# EAGLE design Adapter (EAGLE 6.5.0)
COPYRIGHT: based on Karl-Heinz Kübbeler's circuit; PROJECT_INFO: Rotary Encoder & Frequency Counter; PROJECT_NAME: Options Adapter for Component Tester
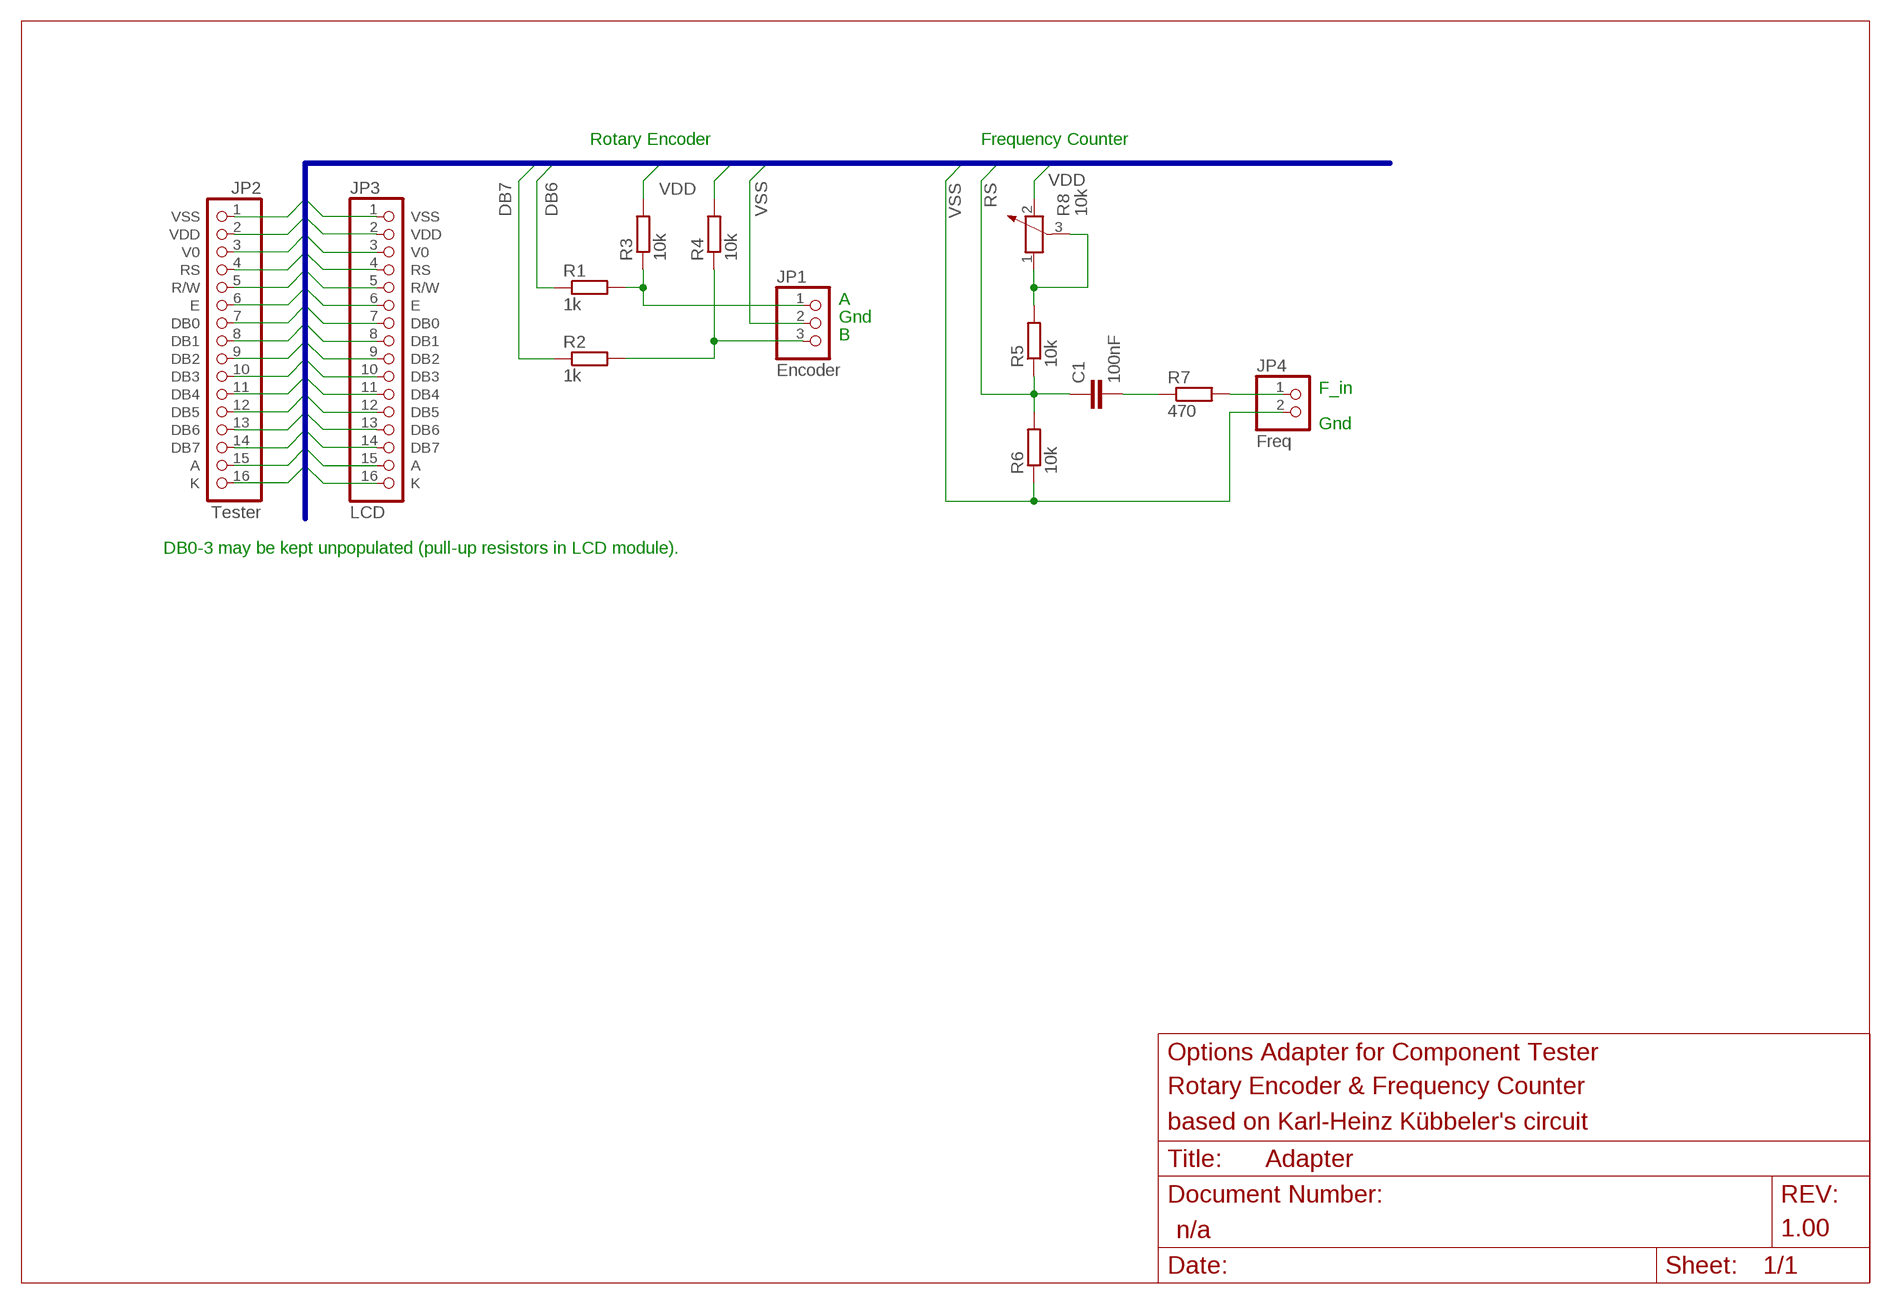
[diagram p0: schematic, sheet 1]
FRAME1 (FRAME_A4): DOCUMENT_ID: n/a; REVISION_ID: 1.00

## Parts
C1  100nF  C-EU050-025X075  [C050-025X075]
JP1  Encoder  PINHD-1X3-PCB  [PINHD-1X03]
JP2  Tester  PINHD-1X16-LCD-TOP  [PINHD-1X16]
JP3  LCD  PINHD-1X16-LCD-TOP  [PINHD-1X16]
JP4  Freq  PINHD-1X2-PCB  [PINHD-1X02]
R1  1k  R-EU_0207/10  [0207/10]
R2  1k  R-EU_0207/10  [0207/10]
R3  10k  R-EU_0207/5V  [0207/5V]
R4  10k  R-EU_0207/5V  [0207/5V]
R5  10k  R-EU_0207/5V  [0207/5V]
R6  10k  R-EU_0207/5V  [0207/5V]
R7  470  R-EU_0207/5V  [0207/5V]
R8  10k  POTENTIOMETER_PT-10  [PT-10]

## Nets
A: JP2.15(A) JP3.15(A)
DB0: JP2.7(DB0) JP3.7(DB0)
DB1: JP2.8(DB1) JP3.8(DB1)
DB2: JP2.9(DB2) JP3.9(DB2)
DB3: JP2.10(DB3) JP3.10(DB3)
DB4: JP2.11(DB4) JP3.11(DB4)
DB5: JP2.12(DB5) JP3.12(DB5)
DB6: JP2.13(DB6) JP3.13(DB6) R1.1
DB7: JP2.14(DB7) JP3.14(DB7) R2.1
E: JP2.6(E) JP3.6(E)
ENC_A: JP1.1 R1.2 R3.1
ENC_B: JP1.3 R2.2 R4.1
K: JP2.16(K) JP3.16(K)
N$3: JP4.1 R7.2
N$4: R5.2 R8.1 R8.3
N$6: C1.2 R7.1
RS: C1.1 JP2.4(RS) JP3.4(RS) R5.1 R6.2
RW: JP2.5(R/W) JP3.5(R/W)
V0: JP2.3(V0) JP3.3(V0)
VDD: JP2.2(VDD) JP3.2(VDD) R3.2 R4.2 R8.2
VSS: JP1.2 JP2.1(VSS) JP3.1(VSS) JP4.2 R6.1

## Buses
LCD:VSS,VDD,V0,RS,RW,E,DB[0..7],A,K

## Notes on the sheet
- Rotary Encoder | Frequency Counter
- A
- Gnd
- B
- F_in
- Gnd
- DB0-3 may be kept unpopulated (pull-up resistors in LCD module).

## Library data of the parts
C1 = rcl:C-EU: CAPACITOR, European symbol
JP1 = m-connectors:PINHD-1X3-PCB: PIN HEADER
JP2 JP3 = m-connectors:PINHD-1X16-LCD: Pin Header for LCD module 16 pin supports bottom and top types
JP4 = m-connectors:PINHD-1X2-PCB: PIN HEADER
R1-R7 = rcl:R-EU_: RESISTOR, European symbol
R8 = m-LCR:POTENTIOMETER: Potentiometer

## Board
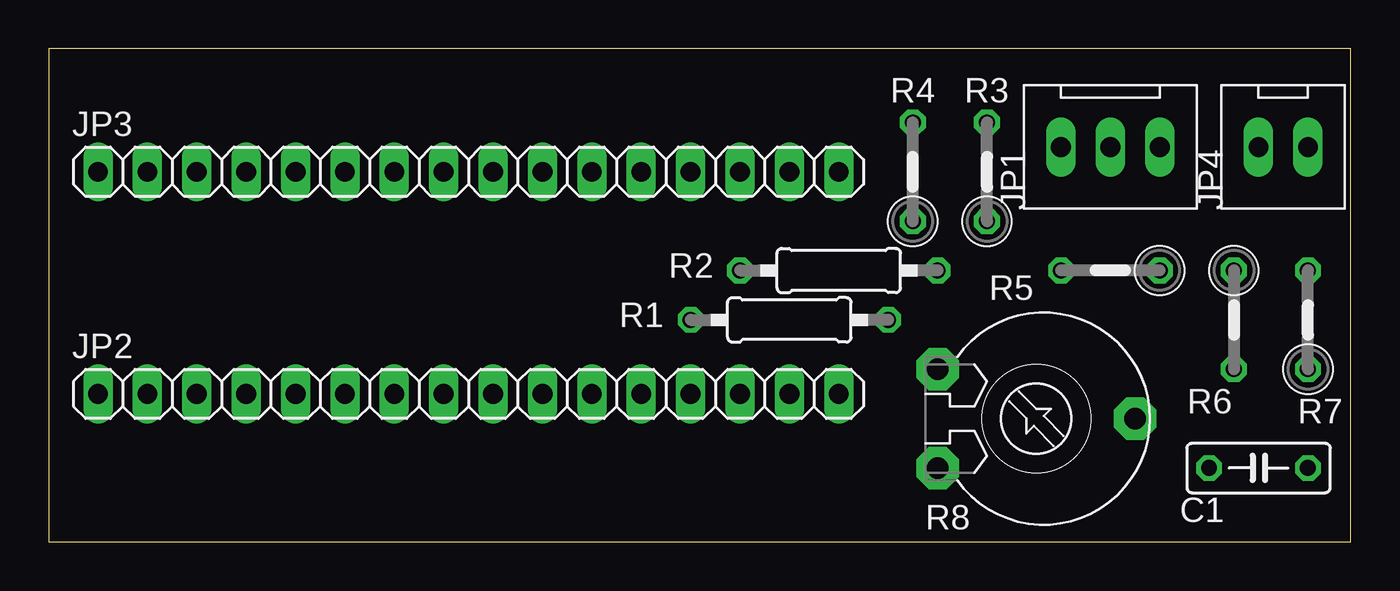
[diagram p1: board, top side]
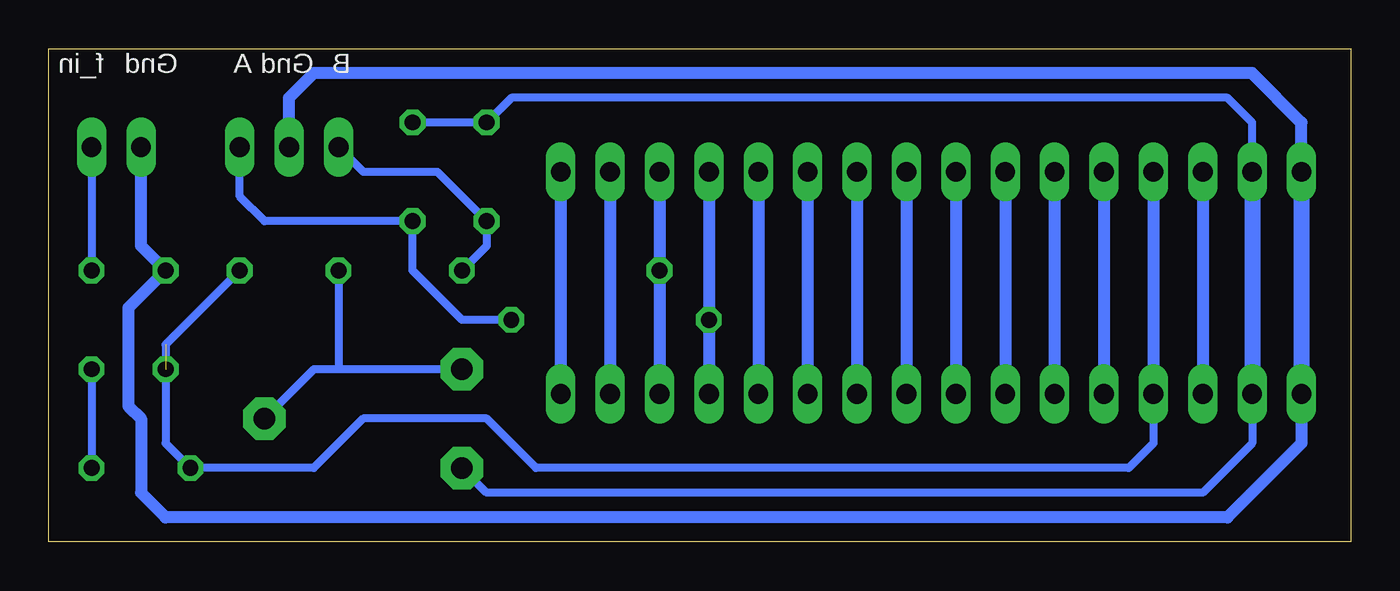
[diagram p2: board, bottom side, seen from below]

Size 66.98 x 25.39 mm. Coordinates in mm from the lower left corner, seen from the top.
Outline: 0,0 66.98,0 66.98,25.39 0,25.39 0,0
Copper layers (1*16): Top 0.035mm / dielectric 1.5mm / Bottom 0.035mm
Design rules "default *": minimum track width 10mil, minimum drill 24mil, track to track 8mil, track to pad 8mil, pad to pad 8mil, via to via 8mil, smd to smd 8mil, copper to edge 40mil, drill to drill 8mil, minimum pad ring 10mil, minimum via ring 8mil, stop-mask expansion 4mil, vias tented up to drill 0mil, thermal gap 10mil

### Footprints (pad centres in the part's own frame; a part is rotated, then mirrored left to right if it is on the bottom)
C050-025X075 = drill 0.813 octagon: 1 -2.54,0; 2 2.54,0
PINHD-1X03 = drill 1.016 long: 1 2.54,0; 2 0,0; 3 -2.54,0
PINHD-1X16 = drill 1.016 long: 1 -19.05,0; 2 -16.51,0; 3 -13.97,0; 4 -11.43,0; 5 -8.89,0; 6 -6.35,0; 7 -3.81,0; 8 -1.27,0; 9 1.27,0; 10 3.81,0; 11 6.35,0; 12 8.89,0; 13 11.43,0; 14 13.97,0; 15 16.51,0; 16 19.05,0
PINHD-1X02 = drill 1.016 long: 1 1.27,0; 2 -1.27,0
0207/10 = drill 0.813 octagon: 1 -5.08,0; 2 5.08,0
0207/5V = drill 0.813 octagon: 1 -2.54,0; 2 2.54,0
PT-10 = drill 1.1 pad 2.184 octagon: 1 -2.54,-5.08; 2 2.54,-5.08; 3 0,5.08

### Placement (x,y rotation side)
C1  62.23,3.81 0 top
JP1  54.61,20.32 0 top
JP2  21.59,7.62 0 top
JP3  21.59,19.05 0 top
JP4  63.5,20.32 0 top
R1  38.1,11.43 0 top
R2  40.64,13.97 0 top
R3  48.26,19.05 90 top
R4  44.45,19.05 90 top
R5  54.61,13.97 180 top
R6  60.96,11.43 270 top
R7  64.77,11.43 90 top
R8  50.8,6.35 270 top

### Tracks (layer width: path | path; a pad name or v marks a point on that pad's centre or on a via)
A
  Bottom 0.61: JP3.15 JP2.15
DB0
  Bottom 0.61: JP3.7 JP2.7
DB1
  Bottom 0.61: JP3.8 JP2.8
DB2
  Bottom 0.61: JP3.9 JP2.9
DB3
  Bottom 0.61: JP3.10 JP2.10
DB4
  Bottom 0.61: JP3.11 JP2.11
DB5
  Bottom 0.61: JP3.12 JP2.12
DB6
  Bottom 0.61: JP3.13 R1.1 JP2.13
DB7
  Bottom 0.61: JP3.14 R2.1 JP2.14
E
  Bottom 0.61: JP3.6 JP2.6
ENC_A
  Bottom 0.406: JP1.1 57.15,17.78 55.88,16.51 R3.1 48.26,13.97 45.72,11.43 R1.2
ENC_B
  Bottom 0.406: JP1.3 50.8,19.05 46.99,19.05 R4.1 44.45,15.24 R2.2
K
  Bottom 0.61: JP3.16 JP2.16
N$3
  Bottom 0.406: JP4.1 R7.2
N$4
  Bottom 0.406: R8.1 52.07,8.89 | 52.07,8.89 53.34,8.89 R8.3 | R5.2 52.07,8.89
N$6
  Bottom 0.406: R7.1 C1.2
RS  (1 unrouted)
  Bottom 0.406: JP2.4 10.16,5.08 11.43,3.81 41.91,3.81 44.45,6.35 50.8,6.35 53.34,3.81 C1.1 60.96,5.08 60.96,10.16 R5.1
  Bottom 0.61: JP3.4 JP2.4
RW
  Bottom 0.61: JP3.5 JP2.5
V0
  Bottom 0.61: JP3.3 JP2.3
VDD
  Bottom 0.406: JP3.2 5.08,21.59 6.35,22.86 43.18,22.86 R4.2 R3.2 | JP2.2 5.08,5.08 7.62,2.54 44.45,2.54 R8.2
  Bottom 0.813: JP3.2 JP2.2
VSS
  Bottom 0.61: JP3.1 2.54,21.59 5.08,24.13 53.34,24.13 54.61,22.86 JP1.2 | JP2.1 2.54,5.08 6.35,1.27 60.96,1.27 62.23,2.54 62.23,6.35 62.87,6.99 62.87,12.06 R6.1 62.23,15.24 JP4.2
  Bottom 0.813: JP3.1 JP2.1

### Text on the board
bNames: B | Gnd | A | Gnd | f_in